# EAGLE design practice 2 (EAGLE 9.4.2)
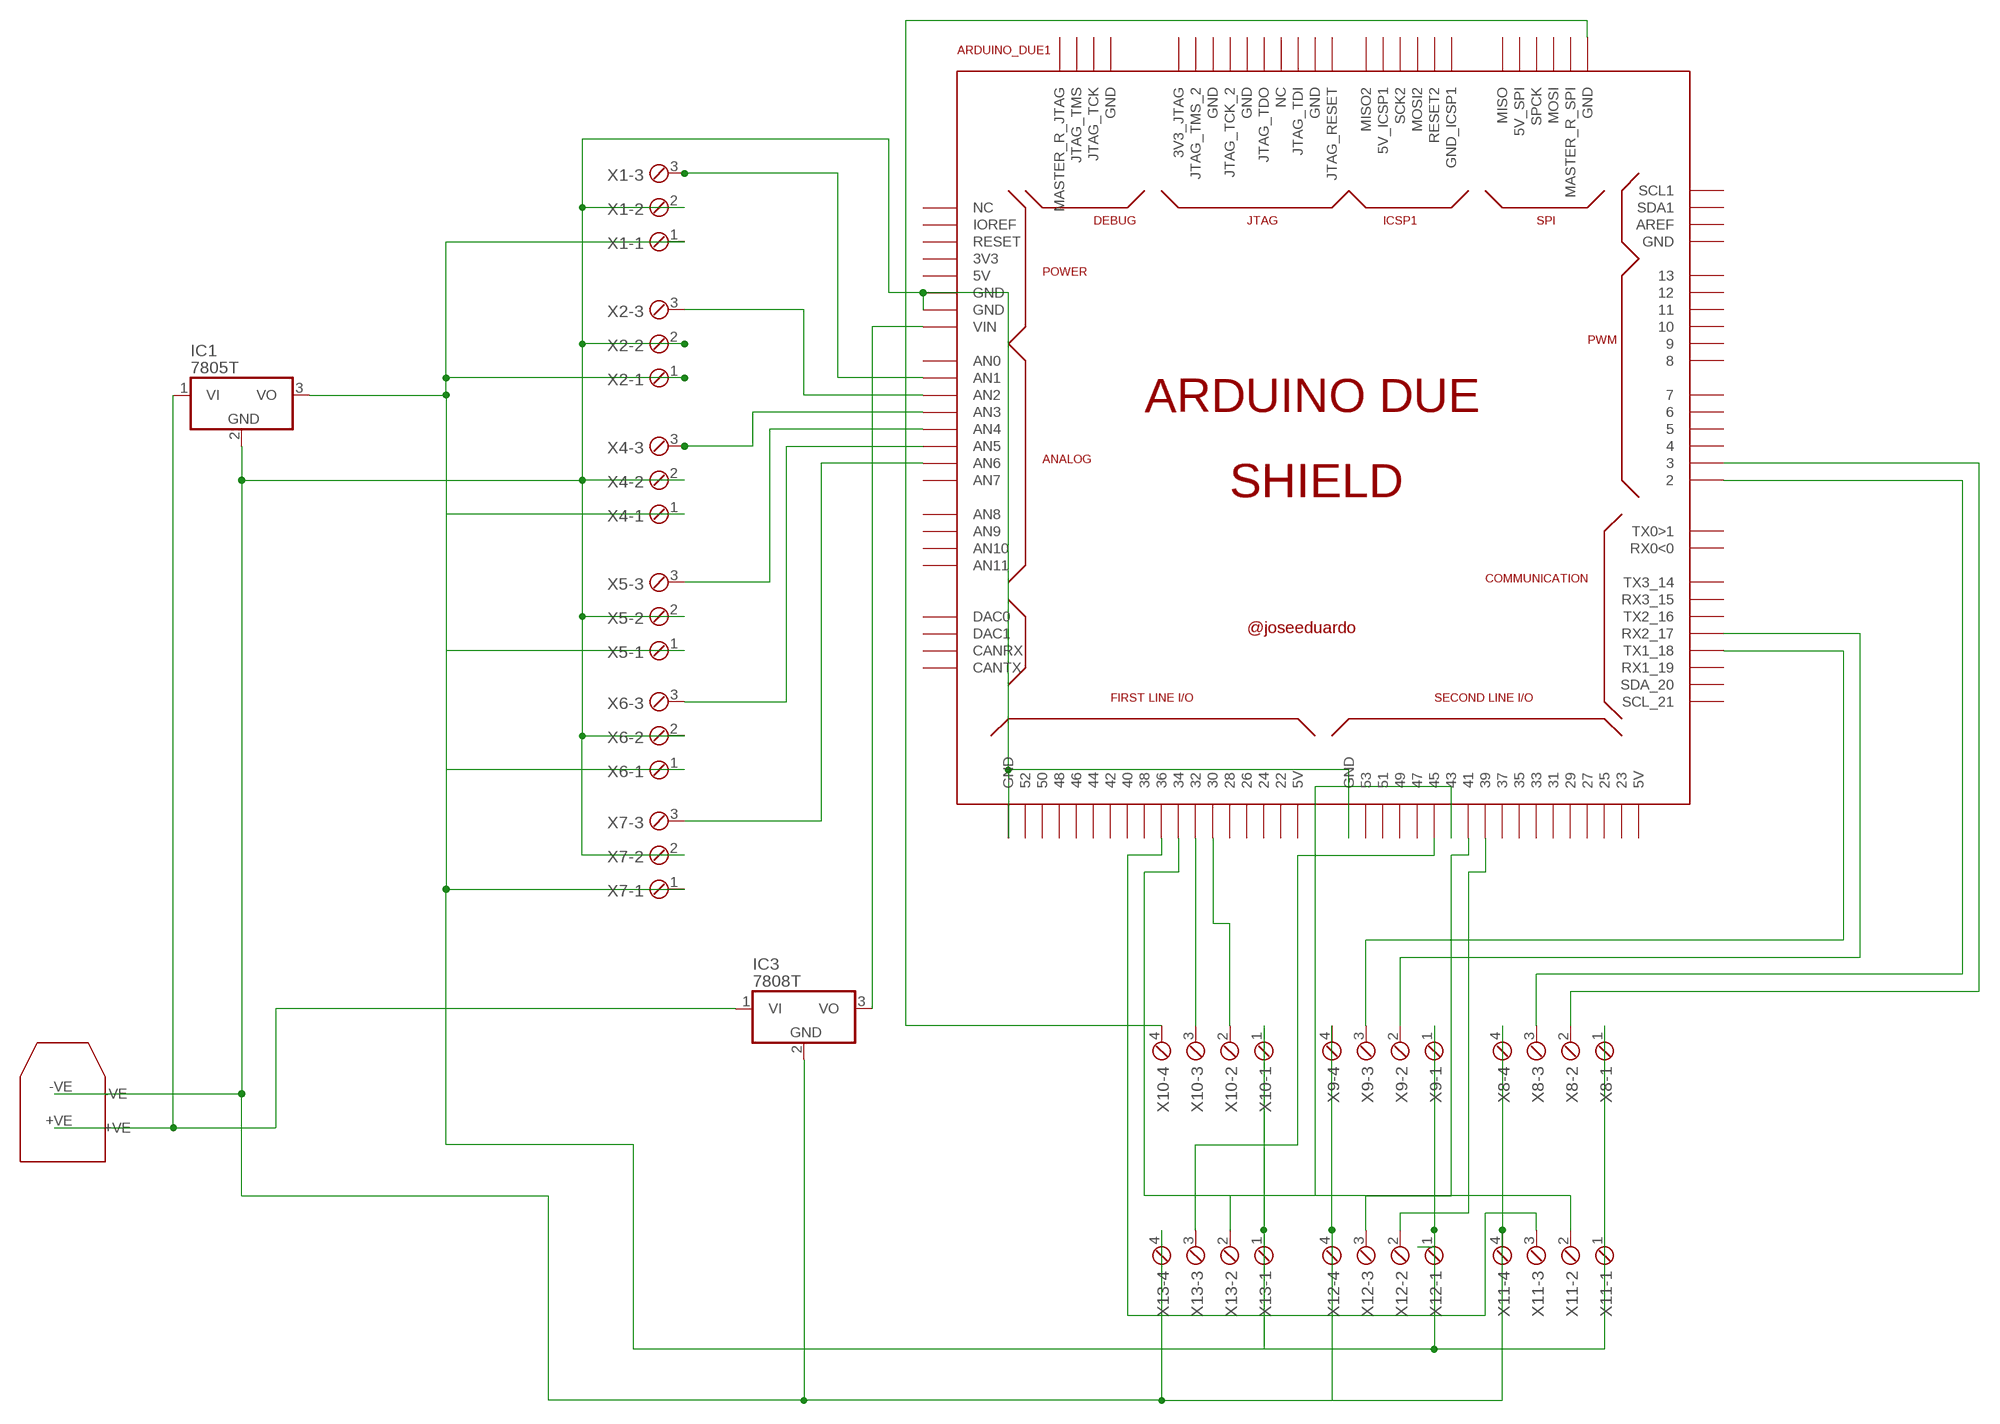
[diagram p0: schematic, sheet 1]

## Parts
ARDUINO_DUE1  ARDUINO_DUE_SHIELD  [ARDUINO_DUE_SHIELD]
IC1  7805T  [TO220H]
IC3  7808T  [TO220H]
U$1  XT60XT60  [XT60]
X1  MPT3  [3POL254]
X2  MPT3  [3POL254]
X4  MPT3  [3POL254]
X5  MPT3  [3POL254]
X6  MPT3  [3POL254]
X7  MPT3  [3POL254]
X8  MPT4  [4POL254]
X9  MPT4  [4POL254]
X10  MPT4  [4POL254]
X11  MPT4  [4POL254]
X12  MPT4  [4POL254]
X13  MPT4  [4POL254]

## Nets
GND: ARDUINO_DUE1.GND ARDUINO_DUE1.GND_1(GND) ARDUINO_DUE1.GND_2(GND) ARDUINO_DUE1.GND_3(GND) IC1.2(GND) IC3.2(GND) U$1.-VE X1.2 X2.2 X4.2 X5.2 X6.2 X7.2 X8.4 X9.4 X11.4 X12.4 X13.4
N$1: ARDUINO_DUE1.36 X11.3
N$3: ARDUINO_DUE1.A2(AN2) X2.3
N$4: ARDUINO_DUE1.A1(AN1) X1.3
N$5: ARDUINO_DUE1.GND_5(GND) X10.4
N$6: ARDUINO_DUE1.A3(AN3) X4.3
N$7: ARDUINO_DUE1.A4(AN4) X5.3
N$8: ARDUINO_DUE1.A5(AN5) X6.3
N$9: ARDUINO_DUE1.A6(AN6) X7.3
N$10: IC1.3(VO) X1.1 X2.1 X4.1 X5.1 X6.1 X7.1 X8.1 X9.1 X10.1 X11.1 X12.1 X13.1
N$14: ARDUINO_DUE1.30 X10.2
N$15: ARDUINO_DUE1.32 X10.3
N$16: IC1.1(VI) IC3.1(VI) U$1.+VE
N$17: ARDUINO_DUE1.34 X11.2
N$19: ARDUINO_DUE1.39 X12.2
N$20: ARDUINO_DUE1.41 X12.3
N$21: ARDUINO_DUE1.45 X13.3
N$22: ARDUINO_DUE1.43 X13.2
N$23: ARDUINO_DUE1.VIN IC3.3(VO)
N$25: ARDUINO_DUE1.18(TX1_18) X9.3
N$26: ARDUINO_DUE1.17(RX2_17) X9.2
N$28: ARDUINO_DUE1.2 X8.3
N$29: ARDUINO_DUE1.3 X8.2
Unconnected: ARDUINO_DUE1.0(RX0<0) ARDUINO_DUE1.1(TX0>1) ARDUINO_DUE1.3V3 ARDUINO_DUE1.3V3_JTAG ARDUINO_DUE1.4 ARDUINO_DUE1.5 ARDUINO_DUE1.5V0(5V) ARDUINO_DUE1.5V0_1(5V) ARDUINO_DUE1.5V0_2(5V) ARDUINO_DUE1.5V_2(5V_SPI) ARDUINO_DUE1.5V_ICSP1 ARDUINO_DUE1.6 ARDUINO_DUE1.7 ARDUINO_DUE1.8 ARDUINO_DUE1.9 ARDUINO_DUE1.10 ARDUINO_DUE1.11 ARDUINO_DUE1.12 ARDUINO_DUE1.13 ARDUINO_DUE1.14(TX3_14) ARDUINO_DUE1.15(RX3_15) ARDUINO_DUE1.16(TX2_16) ARDUINO_DUE1.19(RX1_19) ARDUINO_DUE1.20(SDA_20) ARDUINO_DUE1.21(SCL_21) ARDUINO_DUE1.22 ARDUINO_DUE1.23 ARDUINO_DUE1.24 ARDUINO_DUE1.25 ARDUINO_DUE1.26 ARDUINO_DUE1.27 ARDUINO_DUE1.28 ARDUINO_DUE1.29 ARDUINO_DUE1.31 ARDUINO_DUE1.33 ARDUINO_DUE1.35 ARDUINO_DUE1.37 ARDUINO_DUE1.38 ARDUINO_DUE1.40 ARDUINO_DUE1.42 ARDUINO_DUE1.44 ARDUINO_DUE1.46 ARDUINO_DUE1.47 ARDUINO_DUE1.48 ARDUINO_DUE1.49 ARDUINO_DUE1.50 ARDUINO_DUE1.51 ARDUINO_DUE1.52 ARDUINO_DUE1.53 ARDUINO_DUE1.A0(AN0) ARDUINO_DUE1.A7(AN7) ARDUINO_DUE1.A8(AN8) ARDUINO_DUE1.A9(AN9) ARDUINO_DUE1.A10(AN10) ARDUINO_DUE1.A11(AN11) ARDUINO_DUE1.AREF ARDUINO_DUE1.CANRX ARDUINO_DUE1.CANTX ARDUINO_DUE1.DAC0 ARDUINO_DUE1.DAC1 ARDUINO_DUE1.GND_4(GND) ARDUINO_DUE1.GND_7(GND) ARDUINO_DUE1.GND_8(GND) ARDUINO_DUE1.GND_9(GND) ARDUINO_DUE1.GND_10(GND) ARDUINO_DUE1.GND_ICSP1 ARDUINO_DUE1.IOREF ARDUINO_DUE1.JTAG_RESET ARDUINO_DUE1.JTAG_TCK ARDUINO_DUE1.JTAG_TCK_2 ARDUINO_DUE1.JTAG_TDI ARDUINO_DUE1.JTAG_TDO ARDUINO_DUE1.JTAG_TMS ARDUINO_DUE1.JTAG_TMS_2 ARDUINO_DUE1.MASTER_RESET_JTAG(MASTER_R_JTAG) ARDUINO_DUE1.MASTER_RESET_SPI(MASTER_R_SPI) ARDUINO_DUE1.MISO ARDUINO_DUE1.MISO2 ARDUINO_DUE1.MOSI ARDUINO_DUE1.MOSI2 ARDUINO_DUE1.NC_2(NC) ARDUINO_DUE1.NC_5(NC) ARDUINO_DUE1.RESET ARDUINO_DUE1.RESET2 ARDUINO_DUE1.SCK2 ARDUINO_DUE1.SCL1 ARDUINO_DUE1.SDA1 ARDUINO_DUE1.SPCK

## Library data of the parts
ARDUINO_DUE1 = arduino_due_shield:ARDUINO_DUE_SHIELD
IC1 IC3 = linear:78*: Positive VOLTAGE REGULATOR Source: http://cache.national.com/ds/LM/LM78L05.pdf http://www.fairchildsemi.com/ds/LM/LM7805.pdf
U$1 = xt60:XT60: XT60 connector
X1 X2 X4-X7 = con-phoenix-254:MPT3: PHOENIX CONNECTOR; OC_FARNELL: unknown; OC_NEWARK: unknown
X8-X13 = con-phoenix-254:MPT4: PHOENIX CONNECTOR; OC_FARNELL: unknown; OC_NEWARK: unknown

## Board
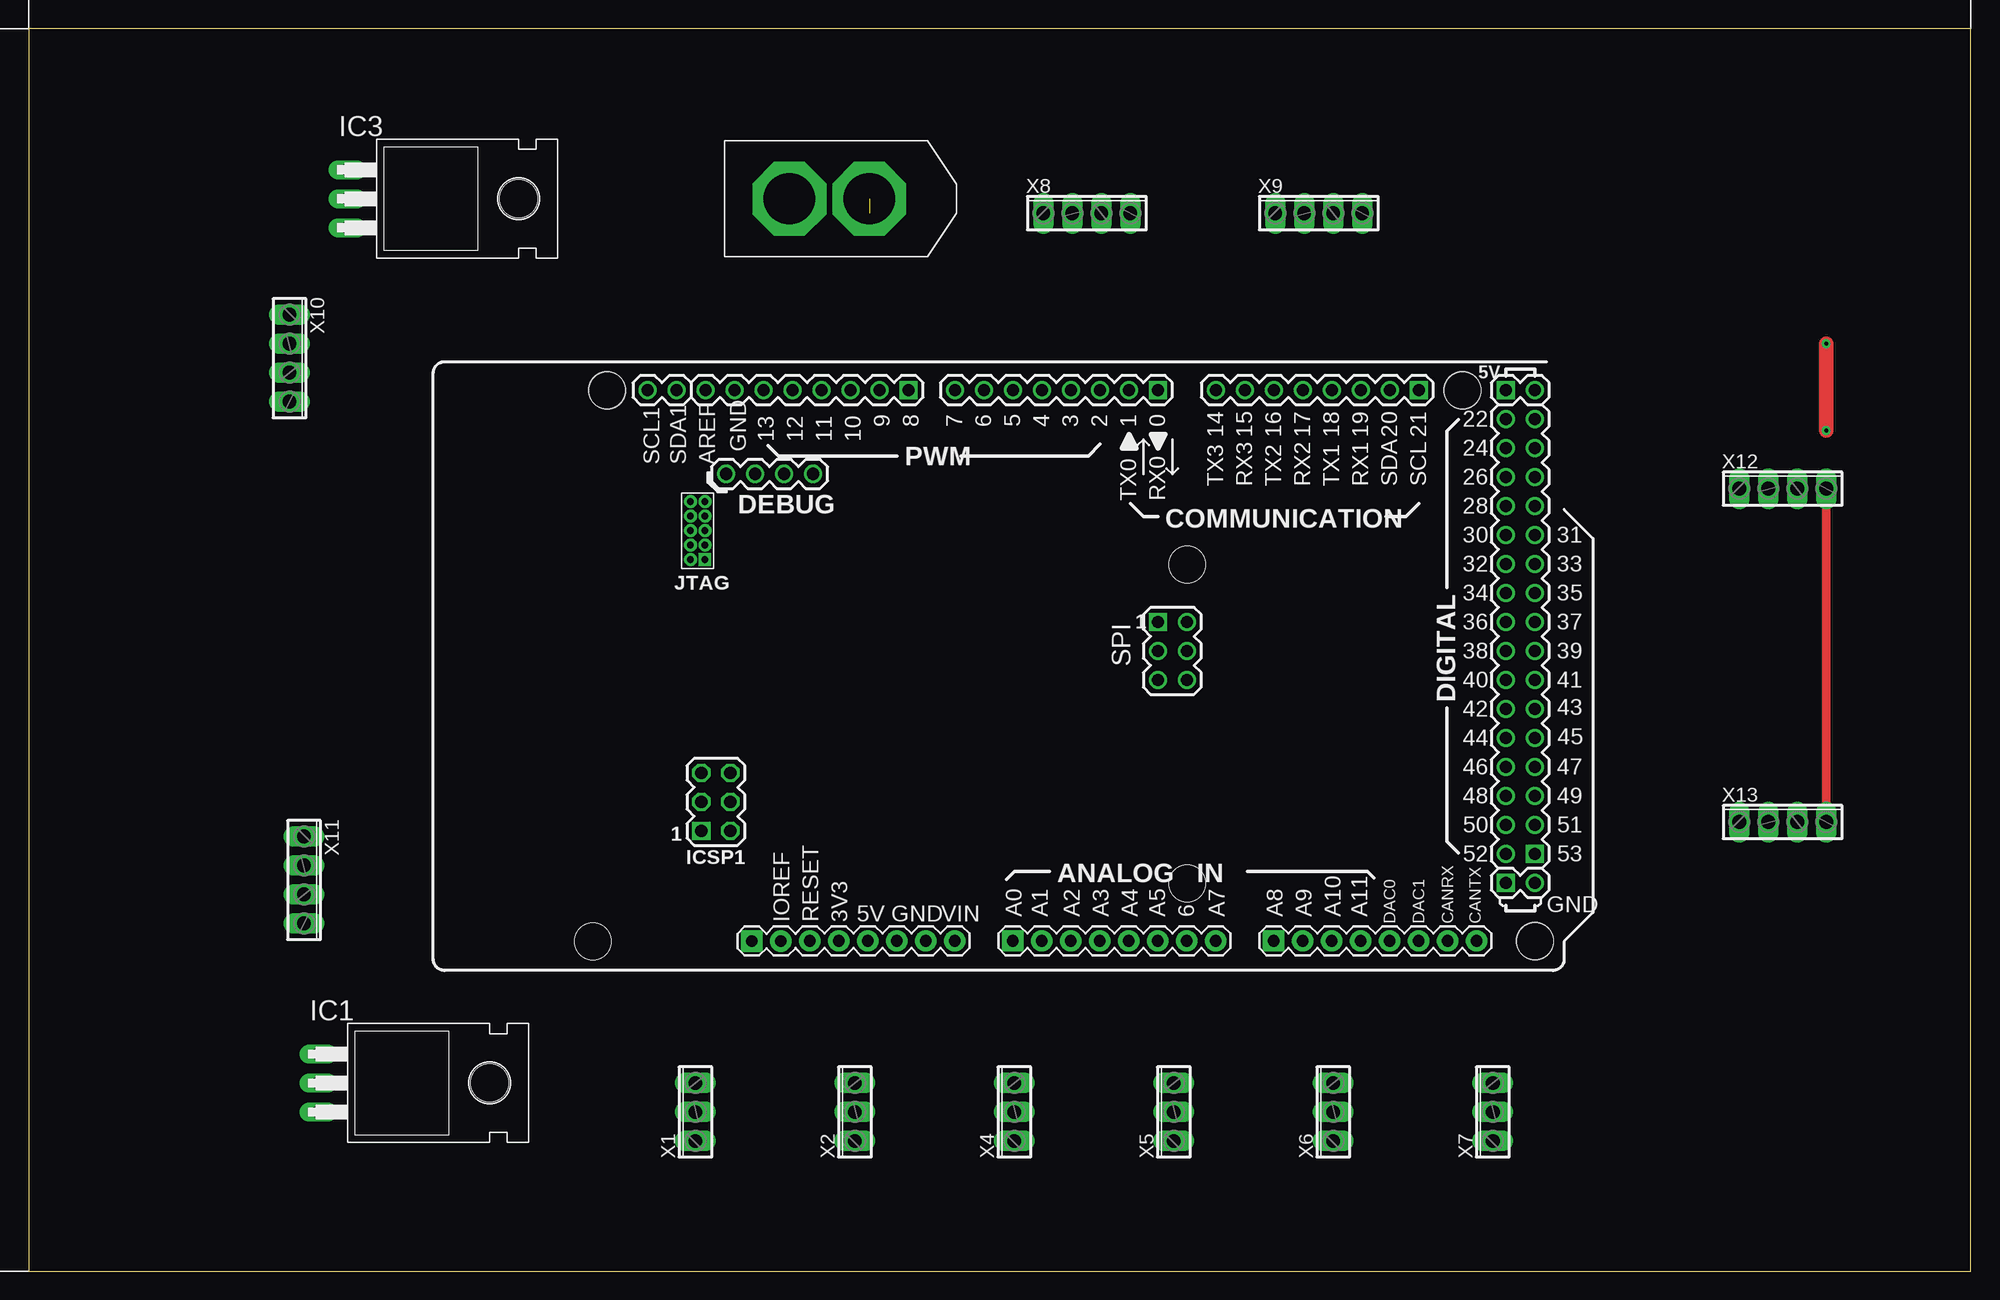
[diagram p1: board, top side]
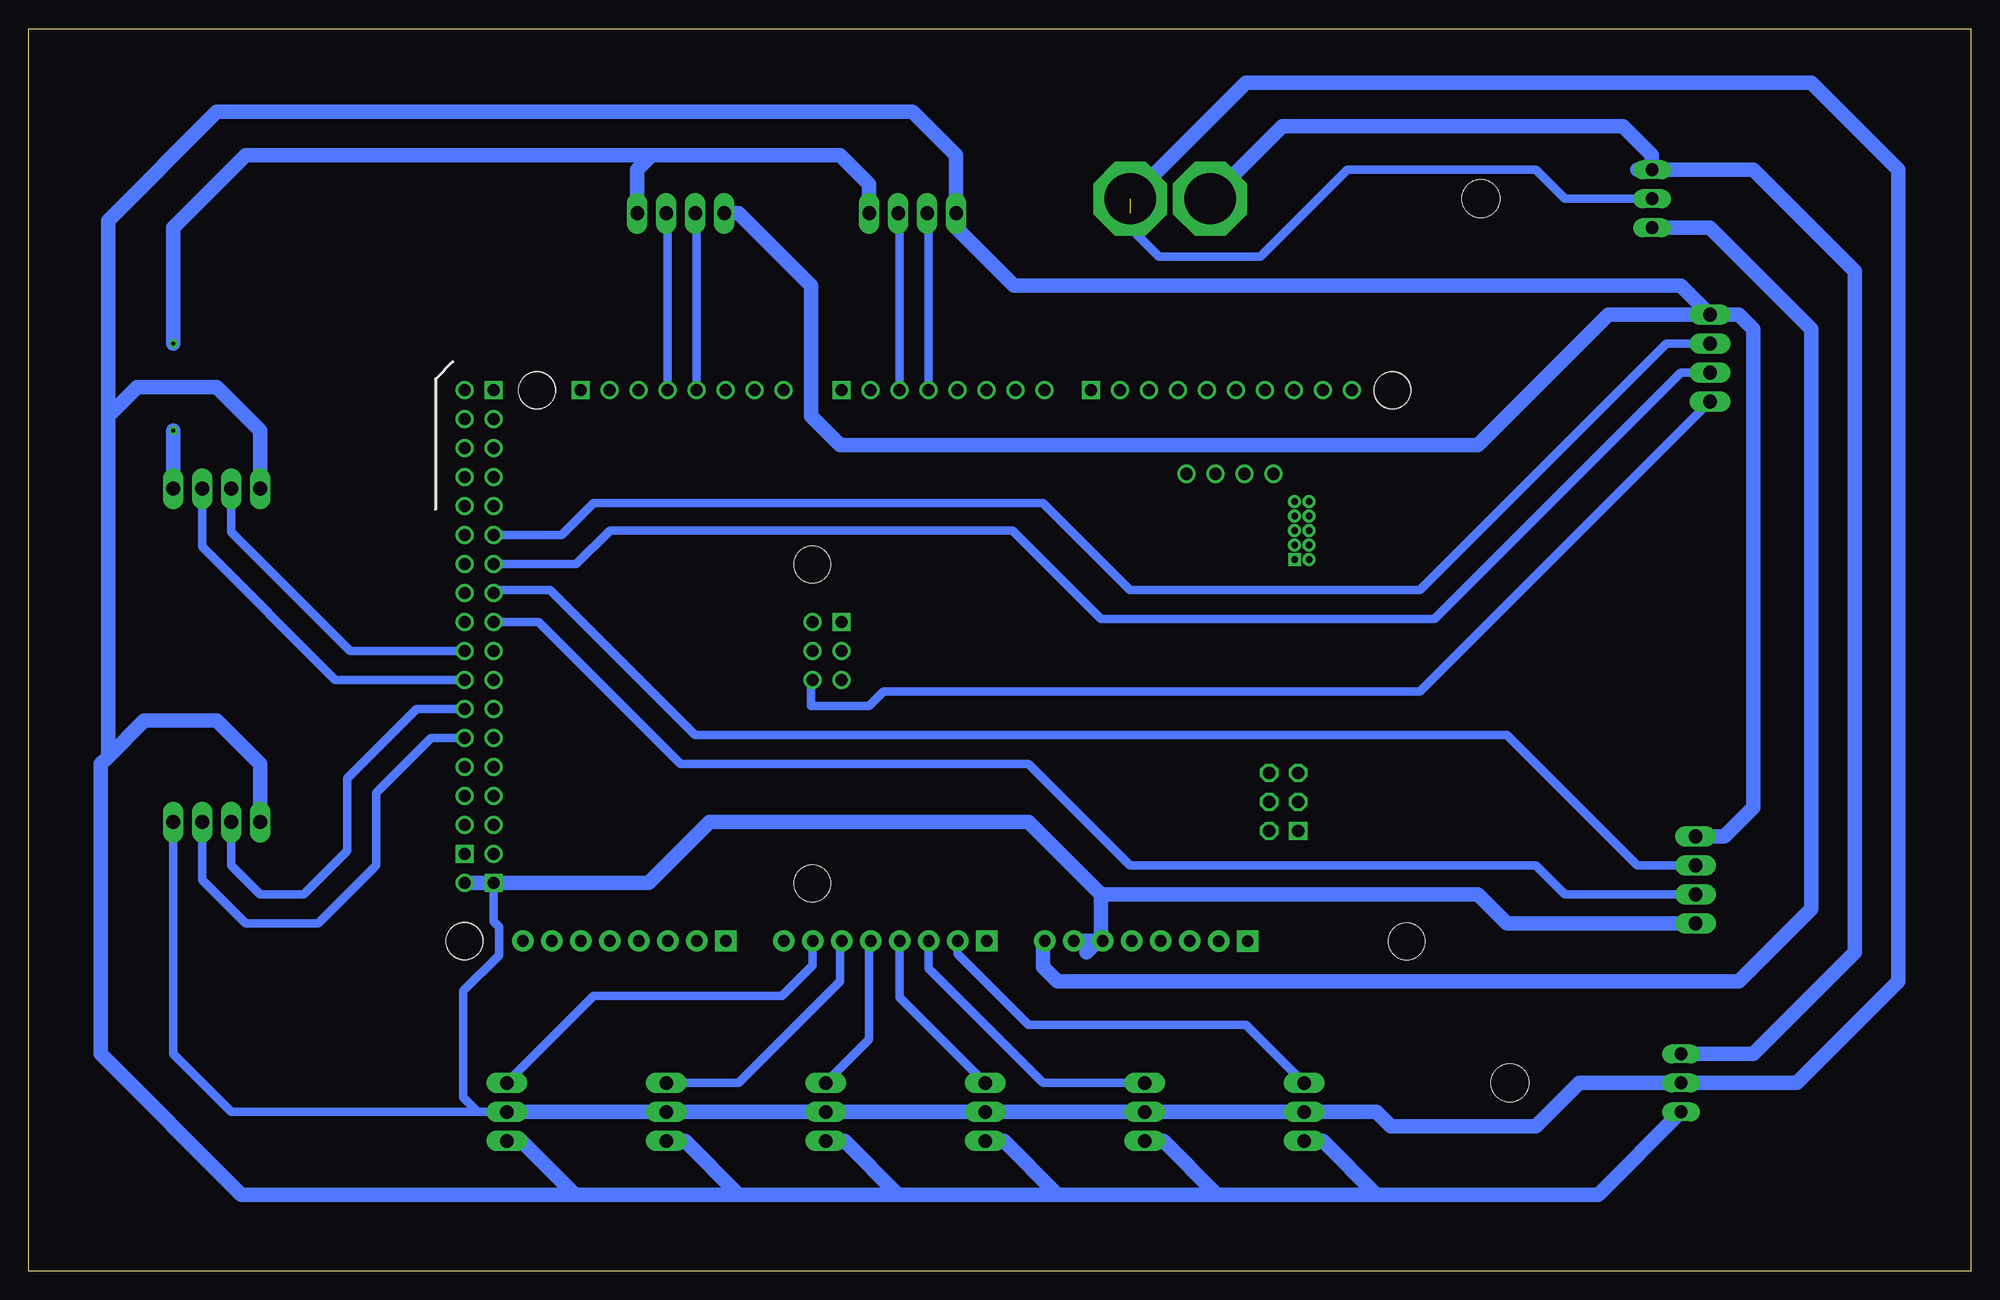
[diagram p2: board, bottom side, seen from below]

Size 170.16 x 108.89 mm. Coordinates in mm from the lower left corner, seen from the top.
Outline: 0,0 170.16,0 170.16,108.89 0,108.89 0,0
Copper layers (1*16): Top 0.035mm / dielectric 1.5mm / Bottom 0.035mm
Design rules "default": minimum track width 6mil, minimum drill 0.35mm, track to track 6mil, track to pad 6mil, pad to pad 6mil, via to via 6mil, smd to smd 6mil, copper to edge 40mil, drill to drill 6mil, minimum pad ring 10mil, minimum via ring 8mil, stop-mask expansion 4mil, vias tented up to drill 0mil, thermal gap 10mil

### Footprints (pad centres in the part's own frame; a part is rotated, then mirrored left to right if it is on the bottom)
ARDUINO_DUE_SHIELD = drill 1.067 square: 0 63.373,51.816; 5V0_1 93.853,51.816; 8 41.529,51.816; 21 86.233,51.816; 53 96.393,11.176; GND_2 93.853,8.636; MISO 63.373,31.496; MISO2 23.384,13.196 | drill 1.067: 1 60.833,51.816; 2 58.293,51.816; 3 55.753,51.816; 4 53.213,51.816; 5 50.673,51.816; 5V0_2 96.393,51.816; 5V_2 65.913,31.496; 6 48.133,51.816; 7 45.593,51.816; 9 38.989,51.816; 10 36.449,51.816; 11 33.909,51.816; 12 31.369,51.816; 13 28.829,51.816; 14 68.453,51.816; 15 70.993,51.816; 16 73.533,51.816; 17 76.073,51.816; 18 78.613,51.816; 19 81.153,51.816; 20 83.693,51.816; 22 93.853,49.276; 23 96.393,49.276; 24 93.853,46.736; 25 96.393,46.736; 26 93.853,44.196; 27 96.393,44.196; 28 93.853,41.656; 29 96.393,41.656; 30 93.853,39.116; 31 96.393,39.116; 32 93.853,36.576; 33 96.393,36.576; 34 93.853,34.036; 35 96.393,34.036; 36 93.853,31.496; 37 96.393,31.496; 38 93.853,28.956; 39 96.393,28.956; 40 93.853,26.416; 41 96.393,26.416; 42 93.853,23.876; 43 96.393,23.876; 44 93.853,21.336; 45 96.393,21.336; 46 93.853,18.796; 47 96.393,18.796; 48 93.853,16.256; 49 96.393,16.256; 50 93.853,13.716; 51 96.393,13.716; 52 93.853,11.176; AREF 23.749,51.816; GND_3 96.393,8.636; GND_4 26.289,51.816; GND_5 65.913,26.416; GND_7 33.161,44.473; JTAG_TCK 30.621,44.473; JTAG_TMS 28.081,44.473; MASTER_RESET_JTAG 25.541,44.473; MASTER_RESET_SPI 63.373,26.416; MOSI 65.913,28.956; SCL1 18.669,51.816; SDA1 21.209,51.816; SPCK 63.373,28.956 | drill 1.016 pad 1.88: 3V3 35.433,3.556; 5V0 37.973,3.556; A1 53.213,3.556; A2 55.753,3.556; A3 58.293,3.556; A4 60.833,3.556; A5 63.373,3.556; A6 65.913,3.556; A7 68.453,3.556; A9 76.073,3.556; A10 78.613,3.556; A11 81.153,3.556; CANRX 88.773,3.556; CANTX 91.313,3.556; DAC0 83.693,3.556; DAC1 86.233,3.556; GND 40.513,3.556; GND_1 43.053,3.556; IOREF 30.346,3.543; RESET 32.893,3.555; VIN 45.593,3.556 | drill 0.6 pad 1.016 square: 3V3_JTAG 23.689,36.964 | drill 1.067 octagon: 5V_ICSP1 25.924,13.196; GND_ICSP1 25.924,18.276; MOSI2 25.924,15.736; RESET2 23.384,18.276; SCK2 23.384,15.736 | drill 1.016 pad 1.88 square: A0 50.673,3.556; A8 73.533,3.556; NC_2 27.806,3.543 | drill 0.6 pad 1.143: GND_8 23.689,38.234; GND_9 23.689,40.774; GND_10 23.689,42.044; JTAG_RESET 22.419,42.044; JTAG_TCK_2 22.419,38.234; JTAG_TDI 22.419,40.774; JTAG_TDO 22.419,39.504; JTAG_TMS_2 22.419,36.964; NC_5 23.689,39.504 | hole 3.2: 15.113,51.816; 90.043,51.816; 96.393,3.556; 96.418,3.505; 15.138,51.765; 90.068,51.765; 13.868,3.505; 65.938,36.525; 65.938,8.585
TO220H = drill 1.118 long: 1 -2.54,-10.16; 2 0,-10.16; 3 2.54,-10.16 | hole 3.302: 0,4.826
XT60 = drill 4.5 pad 6.452 octagon: +VE 0,-7; -VE 0,0
3POL254 = drill 1.2 long: 1 -2.54,0; 2 0,0; 3 2.54,0
4POL254 = drill 1.2 long: 1 -3.81,0; 2 -1.27,0; 3 1.27,0; 4 3.81,0

### Placement (x,y rotation side)
ARDUINO_DUE1  35.56,25.4 0 top
IC1  35.56,16.51 270 top
IC3  38.1,93.98 270 top
U$1  73.66,93.98 270 top
X1  58.42,13.97 90 top
X2  72.39,13.97 90 top
X4  86.36,13.97 90 top
X5  100.33,13.97 90 top
X6  114.3,13.97 90 top
X7  128.27,13.97 90 top
X8  92.71,92.71 0 top
X9  113.03,92.71 0 top
X10  22.86,80.01 270 top
X11  24.13,34.29 270 top
X12  153.67,68.58 0 top
X13  153.67,39.37 0 top

### Tracks (layer width: path | path; a pad name or v marks a point on that pad's centre or on a via)
GND  (via drill 0.35)  (1 unrouted)
  Top 0.762: X13.4 X12.4
  Top 1.27: v157.48,81.28 v157.48,73.66
  Bottom 0.762: ARDUINO_DUE1.GND_2 129.41,30.66 128.96,30.2 128.96,27.69 132.08,24.56 132.08,15.24 130.81,13.97 | X7.2 130.81,13.97 | X13.4 157.48,19.05 152.4,13.97 130.81,13.97 | 77.47,27.94 77.47,28.96 | IC3.2 35.56,93.98 38.1,96.52 54.61,96.52 62.23,88.9 71.12,88.9 73.66,91.44 73.66,92.71
  Bottom 1.27: X7.2 X6.2 X5.2 X4.2 X2.2 X1.2 52.07,13.97 50.8,12.7 38.1,12.7 34.29,16.51 IC1.2 15.24,16.51 6.35,25.4 6.35,96.52 13.97,104.14 63.5,104.14 U$1.-VE | ARDUINO_DUE1.GND_1 77.47,28.96 ARDUINO_DUE1.GND | ARDUINO_DUE1.GND_3 ARDUINO_DUE1.GND_2 115.82,34.04 110.49,39.37 82.55,39.37 76.2,33.02 | X8.4 96.52,95.25 99.06,97.79 115.57,97.79 | 115.57,97.79 151.13,97.79 157.48,91.44 v157.48,81.28 | X9.4 116.84,96.52 115.57,97.79 | 76.2,33.02 43.18,33.02 40.64,30.48 X11.4 | 76.2,33.02 76.2,29.21 77.47,27.94 | v157.48,73.66 X12.4
N$1
  Bottom 0.762: ARDUINO_DUE1.36 125.48,56.9 113.03,44.45 82.55,44.45 73.66,35.56 38.1,35.56 35.56,33.02 X11.3
N$3
  Bottom 0.762: ARDUINO_DUE1.A2 91.31,26.54 81.28,16.51 X2.3
N$4
  Bottom 0.762: X1.3 63.5,21.59 82.55,21.59 88.77,27.81 ARDUINO_DUE1.A1
N$5
  Bottom 0.762: 24.13,76.2 X10.4 48.26,50.8 95.25,50.8 96.52,49.53 101.6,49.53 101.6,51.69 ARDUINO_DUE1.GND_5 101.47,51.94 101.6,52.07
N$6
  Bottom 0.762: X4.3 93.85,24 ARDUINO_DUE1.A3
N$7
  Bottom 0.762: ARDUINO_DUE1.A4 96.52,28.83 96.52,20.32 X5.3
N$8
  Bottom 0.762: ARDUINO_DUE1.A5 99.06,28.83 99.06,25.4 107.95,16.51 X6.3
N$9
  Bottom 0.762: X7.3 120.65,24.13 104.14,24.13 101.47,26.8 ARDUINO_DUE1.A6
N$10
  Bottom 1.27: IC1.3 32.64,6.73 52.07,6.73 | 107.95,6.73 122.3,6.73 | 107.95,6.73 93.98,6.73 | 93.98,6.73 80.01,6.73 | 80.01,6.73 66.04,6.73 | 66.04,6.73 52.07,6.73 | 52.07,6.73 56.77,11.43 X1.1 | 66.04,6.73 70.74,11.43 X2.1 | 80.01,6.73 84.71,11.43 X4.1 | 93.98,6.73 98.68,11.43 X5.1 | 107.95,6.73 112.65,11.43 X6.1 | X7.1 127,11.43 122.3,6.73 | 122.3,6.73 151.51,6.73 163.83,19.05 163.83,44.45 163.19,45.09 | X13.1 149.86,44.45 153.67,48.26 160.02,48.26 163.19,45.09 | 163.19,45.09 163.19,74.93 | 163.19,74.93 163.19,92.08 153.67,101.6 92.71,101.6 88.9,97.79 X8.1 88.9,91.44 83.82,86.36 25.4,86.36 X10.1 | X12.1 149.86,73.66 153.67,77.47 160.66,77.47 163.19,74.93 | X9.1 107.95,92.71 101.6,86.36 101.6,74.93 99.06,72.39 43.18,72.39 31.75,83.82 X10.1 | X11.1 21.59,38.1 19.05,40.64 19.05,82.55 20.32,83.82 X10.1 | 21.59,83.82 X10.1
N$14
  Bottom 0.762: ARDUINO_DUE1.30 123.44,64.52 120.65,67.31 81.28,67.31 73.66,59.69 48.26,59.69 26.67,81.28 X10.2
N$15
  Bottom 0.762: ARDUINO_DUE1.32 122.17,61.98 119.23,64.92 83.97,64.92 76.2,57.15 46.99,57.15 25.4,78.74 X10.3
N$16
  Bottom 1.27: IC3.1 29.21,96.52 | IC3.1 27.94,97.79 30.48,100.33 60.31,100.33 U$1.+VE | IC3.1 19.05,96.52 10.16,87.63 10.16,27.94 19.05,19.05 IC1.1
N$17
  Bottom 0.762: X11.2 29.21,35.56 40.64,46.99 111.76,46.99 124.46,59.69 129.16,59.69 ARDUINO_DUE1.34
N$19
  Bottom 0.762: ARDUINO_DUE1.39 141.99,54.36 152.4,64.77 X12.2
N$20
  Bottom 0.762: ARDUINO_DUE1.41 143.28,51.82 154.95,63.49 154.95,68.57 X12.3
N$21
  Bottom 0.762: ARDUINO_DUE1.45 134.87,46.74 139.7,41.91 139.7,35.56 144.78,30.48 151.13,30.48 154.94,34.29 X13.3
N$22
  Bottom 0.762: X13.2 152.4,35.56 149.86,33.02 146.05,33.02 142.24,36.83 142.24,43.18 136.14,49.28 ARDUINO_DUE1.43
N$23
  Bottom 0.762: 81.28,29.08 ARDUINO_DUE1.VIN
  Bottom 1.27: IC3.3 22.86,91.44 13.97,82.55 13.97,31.75 20.32,25.4 80.01,25.4 81.28,26.67 81.28,28.83 ARDUINO_DUE1.VIN
N$25
  Bottom 0.762: ARDUINO_DUE1.18 114.17,92.58 X9.3
N$26
  Bottom 0.762: 111.76,91.44 X9.2 111.63,92.58 ARDUINO_DUE1.17
N$28
  Bottom 0.762: ARDUINO_DUE1.2 93.85,92.58 X8.3
N$29
  Bottom 0.762: ARDUINO_DUE1.3 91.31,92.58 X8.2